# Altium schematic sheet PWR_TPS62821-2-3.SchDoc
size A3; SheetNumber: 1; SheetTotal: 1
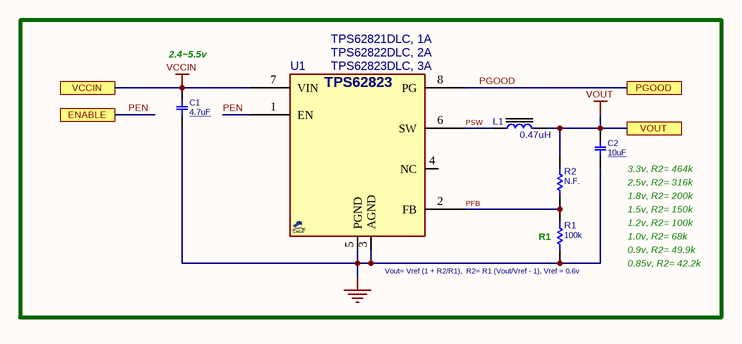
[diagram p0: PWR_TPS62821-2-3.SchDoc]

## Parts
C1  4.7uF  [C0402A]
C2  10uF  [C0402A]
L1  0.47uH  [L0805OVER]
R1  100k  [R0402A]
R2  N.F.  [R0402A]
U1  TPS62823  [SON50_8_2015]  (value not drawn)

## Ports
ENABLE, PGOOD, VCCIN, VOUT

## Nets
GND: C1.2 C2.2 R1.1 U1.3(AGND) U1.5(PGND)
VCCIN: C1.1 U1.7(VIN) ; port VCCIN
VOUT: C2.1 L1.2 R2.2 ; port VOUT
PEN: U1.1(EN) ; port ENABLE
PFB: R1.2 R2.1 U1.2(FB)
PGOOD: U1.8(PG) ; port PGOOD
PSW: L1.1 U1.6(SW)

Not connected (* = marked no-connect by the designer): U1 4(NC)

## Notes on the sheet
- (near C1) 2.4~5.5v
- (near U1) TPS62821DLC, 1A
- (near U1) TPS62823DLC, 3A
- (near U1) TPS62822DLC, 2A
- (near C2) 3.3v, R2= 464k
- (near C2) 2.5v, R2= 316k
- (near R1) R1
- 1.2v, R2= 100k
- 1.8v, R2= 200k
- 1.5v, R2= 150k
- 1.0v, R2= 68k
- 0.9v, R2= 49.9k
- Vout= Vref (1 + R2/R1),  R2= R1 (Vout/Vref - 1), Vref = 0.6v
- 0.85v, R2= 42.2k

## Library data of the parts
C1 = CAP_SMD_MLCC: CAP, MLCC; PARAM: X5R, 20%; MANF_P#: GRM155R61A475MEAAD; PARAM2: 10v; PRICE: 100= 1$; DESC: CAP, MLCC; MANF: -; ASSEMBLY: ASSEMBLY; VALUE: 4.7uF
C2 = CAP_SMD_MLCC: CAP, MLCC; PARAM: X5R, 20%; MANF_P#: CL05A106MP5NUNC; PARAM2: 10v; PRICE: 100= 1$; DESC: CAP, MLCC; MANF: -; ASSEMBLY: ASSEMBLY; VALUE: 10uF
L1 = INDPWR_SMD: INDUCTOR, POWER, SMD; MANF_P#: SRP0420-R68K; PARAM: 10A, 10mDCR; VALUE: 0.47uH
R1 R2 = RES_SMD: RESISTOR, SMD; PARAM: -W; DESC: DESCRIPTION; DIST#: MOUSER; PARAM2: 1%; MANF_P#: -; MANF: -; ASSEMBLY: ASSEMBLY; PRICE: 100= 0.5$
  R1: VALUE: 100k
  R2: VALUE: N.F.
U1 = VREG_TPS62823_SON8: REG, Switching, Buck, 3A, ADJ, 2.2MHz, 2.4~5.5VIN, SON-8; MANF_P#: TPS62823DLC; MANF: Texas Instruments; PARAM: 3A, ADJ, -40~85oC; ASSEMBLY: ASSEMBLY; PARAM2: 2.2MHz, 2.4~5.5VIN; PRICE: 1$; VALUE: TPS62823